# Altium schematic sheet Relay_Driver.SchDoc: Relay Unit
size A; SheetNumber: 3; SheetTotal: 4
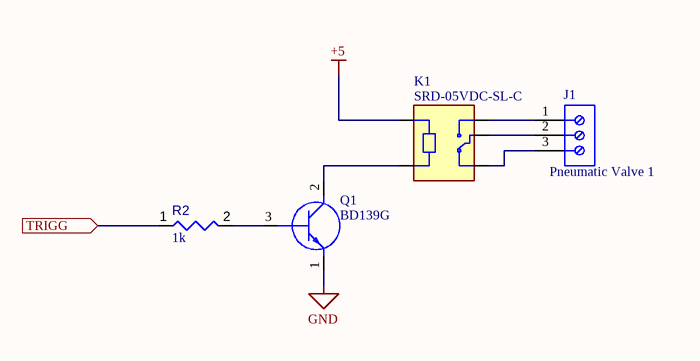
[diagram p0: Relay_Driver.SchDoc]

## Parts
J1  Pneumatic Valve 1  [691101710003]
K1  SRD-05VDC-SL-C  [RELAY_SRD-05VDC-SL-C]
Q1  BD139G  [TO229P300X760X1364-3P]
R2  value 1k  [RESA60-630X240]  (hidden comment: MFR-25FBF52-1K)

## Ports
TRIGG (in)

## Nets
+5: K1.A1
GND: Q1.1(E)
TRIGG: R2.1 ; port TRIGG
NetJ1_1: J1.1 K1.NO
NetJ1_2: J1.2 K1.COM
NetJ1_3: J1.3 K1.NC
NetK1_A2: K1.A2 Q1.2(C)
NetQ1_3: Q1.3(B) R2.2

## Library data of the parts
J1 = CMP-1502-03257-2: NexarPartId: 8917705; Voltage Rating: 250V; Current: 16A; Wire Gauge (Min): 14AWG; Pitch: 5.0038mm; Wire Gauge (Max): 26AWG; Number of Positions Per Level: 3; Plating: Steel; Number of Levels: 1; Stripping Length: -7mm; REACH SVHC: Unknown; Width: 16.2mm; Height: 16.4mm; Contact Material: Brass; RoHS: Compliant; Color: Blue; Contact Plating: Tin; Lead Pitch: 5mm; Packaging: Box; Termination: Screw; Number of Contacts: 3; Wire/Cable Gauge: 26AWG; Min Operating Temperature: -40°C; Max Operating Temperature: 105°C; Housing Material: Nylon; Length: 9mm; Voltage: 250V; Mount: Through Hole; Current Rating: 16A; Number of Pins: 3
K1 = SRD-05VDC-SL-C: 5V Trigger Relay Module For Arduino And Raspberry Pi 5V Trigger Relay Module For Arduino And Raspberry Pi; MF: Songle Relay; Check_prices: https://www.snapeda.com/parts/SRD-05VDC-SL-C/Songle+Relay/view-part/?ref=eda; Value: *; Availability: Not in stock; Price: None; Package: NON STANDARD-5 Songle Relay; MP: SRD-05VDC-SL-C; SnapEDA_Link: https://www.snapeda.com/parts/SRD-05VDC-SL-C/Songle+Relay/view-part/?ref=snap
Q1 = BD139G: Transistor BJT NPN; Manufacturer_Name: onsemi; Datasheet Link: http://www.onsemi.com/pub/Collateral/BD135-D.PDF; Height: 3mm; Manufacturer_Part_Number: BD139G; Mouser Part Number: 863-BD139G; Mouser Price/Stock: https://www.mouser.co.uk/ProductDetail/onsemi/BD139G?qs=vNc2DXHODiLIqGggNMT6cg%3D%3D; Arrow Part Number: BD139G; Arrow Price/Stock: https://www.arrow.com/en/products/bd139g/on-semiconductor?region=nac
R2 = CMP-009-00048-4: Axial Resistor, 1 KOhm, +/- 1%, 250 mW, -55 to 155 degC, 2-Pin THD, RoHS, Bulk; Manufacturer: Yageo; Voltage Rating: 250V; Power: 250mW; Min Operating Temperature: -55°C; Max Operating Temperature: 155°C; Tolerance: 1%; Package Reference: MFR-25; Composition: CarbonFilm; Mounting Technology: TH; Packaging: Bulk; Case/Package: Axial; Datasheet URL: http://www.yageo.com/documents/recent/Yageo%20LR_MFR_2013.pdf; Package Quantity: 200; Manufacturer URL: http://www.yageo.com/; Package Description: 2-Pin Axial Lead, Dia 2.4 mm, Body Length 6.3 mm; Datasheet Version: Apr-13; RoHS Compliant: True